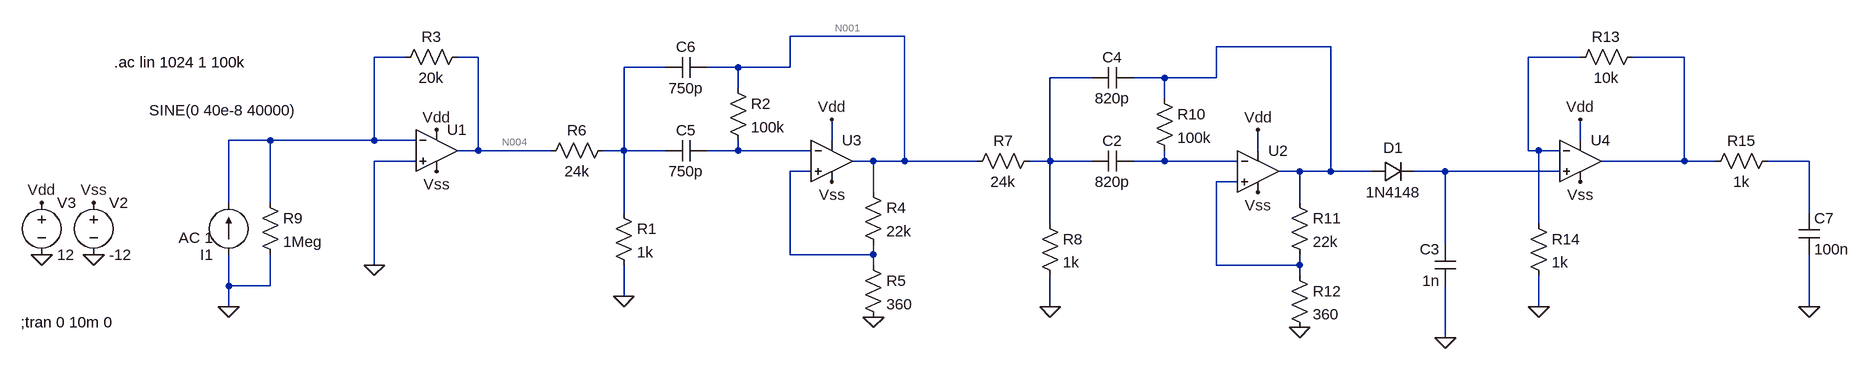
[diagram p0: schematic simulation20kHz(real).asc]
simulation20kHz(real).asc, the LTspice schematic file:
Version 4
SHEET 1 2420 680
WIRE 160 -224 -16 -224
WIRE 816 -208 640 -208
WIRE -608 -192 -656 -192
WIRE -496 -192 -528 -192
WIRE 1200 -192 1120 -192
WIRE 1360 -192 1280 -192
WIRE -208 -176 -272 -176
WIRE -96 -176 -144 -176
WIRE -16 -176 -16 -224
WIRE -16 -176 -96 -176
WIRE 448 -160 384 -160
WIRE 560 -160 512 -160
WIRE 640 -160 640 -208
WIRE 640 -160 560 -160
WIRE -96 -144 -96 -176
WIRE 560 -128 560 -160
WIRE -816 -64 -880 -64
WIRE -656 -64 -656 -192
WIRE -656 -64 -816 -64
WIRE -592 -64 -656 -64
WIRE 48 -64 48 -96
WIRE 1200 -64 1200 -96
WIRE -496 -48 -496 -192
WIRE -496 -48 -528 -48
WIRE -384 -48 -496 -48
WIRE -272 -48 -272 -176
WIRE -272 -48 -304 -48
WIRE -208 -48 -272 -48
WIRE -96 -48 -96 -64
WIRE -96 -48 -144 -48
WIRE 16 -48 -96 -48
WIRE 704 -48 704 -80
WIRE 1120 -48 1120 -192
WIRE 1136 -48 1120 -48
WIRE 1168 -48 1136 -48
WIRE -592 -32 -656 -32
WIRE 112 -32 80 -32
WIRE 160 -32 160 -224
WIRE 160 -32 112 -32
WIRE 272 -32 160 -32
WIRE 384 -32 384 -160
WIRE 384 -32 352 -32
WIRE 448 -32 384 -32
WIRE 560 -32 560 -48
WIRE 560 -32 512 -32
WIRE 672 -32 560 -32
WIRE 1360 -32 1360 -192
WIRE 1360 -32 1232 -32
WIRE 1408 -32 1360 -32
WIRE 1552 -32 1488 -32
WIRE 16 -16 -16 -16
WIRE 768 -16 736 -16
WIRE 816 -16 816 -208
WIRE 816 -16 768 -16
WIRE 880 -16 816 -16
WIRE 992 -16 944 -16
WIRE 1168 -16 992 -16
WIRE 672 0 640 0
WIRE 112 16 112 -32
WIRE -880 32 -880 -64
WIRE -816 32 -816 -64
WIRE 768 32 768 -16
WIRE -272 48 -272 -48
WIRE 1552 48 1552 -32
WIRE 384 64 384 -32
WIRE 1136 64 1136 -48
WIRE 992 96 992 -16
WIRE -16 112 -16 -16
WIRE 112 112 112 96
WIRE 112 112 -16 112
WIRE -656 128 -656 -32
WIRE 112 128 112 112
WIRE 640 128 640 0
WIRE 768 128 768 112
WIRE 768 128 640 128
WIRE 768 144 768 128
WIRE -880 160 -880 112
WIRE -816 160 -816 112
WIRE -816 160 -880 160
WIRE -272 176 -272 128
WIRE -880 192 -880 160
WIRE 384 192 384 144
WIRE 1136 192 1136 144
WIRE 1552 192 1552 112
WIRE 992 240 992 160
FLAG -1088 112 0
FLAG -1168 112 0
FLAG -1168 32 Vdd
FLAG -1088 32 Vss
FLAG -560 -16 Vss
FLAG -560 -80 Vdd
FLAG -880 192 0
FLAG -656 128 0
FLAG 48 0 Vss
FLAG 48 -96 Vdd
FLAG 112 208 0
FLAG -272 176 0
FLAG 704 16 Vss
FLAG 704 -80 Vdd
FLAG 768 224 0
FLAG 384 192 0
FLAG 1200 0 Vss
FLAG 1200 -96 Vdd
FLAG 992 240 0
FLAG 1136 192 0
FLAG 1552 192 0
SYMBOL Opamps\\UniversalOpamp2 -560 -48 R0
SYMATTR InstName U1
SYMBOL voltage -1088 16 R0
WINDOW 123 0 0 Left 2
WINDOW 39 0 0 Left 2
SYMATTR InstName V2
SYMATTR Value -12
SYMBOL voltage -1168 16 R0
SYMATTR InstName V3
SYMATTR Value 12
SYMBOL res -512 -208 R90
WINDOW 0 0 56 VBottom 2
WINDOW 3 32 56 VTop 2
SYMATTR InstName R3
SYMATTR Value 20k
SYMBOL current -880 112 R180
WINDOW 3 -106 222 Left 2
WINDOW 123 24 26 Left 2
WINDOW 39 0 0 Left 2
SYMATTR Value SINE(0 40e-8 40000)
SYMATTR Value2 AC 1
SYMATTR InstName I1
SYMBOL Opamps\\UniversalOpamp2 48 -32 R0
SYMATTR InstName U3
SYMBOL res -288 -64 R90
WINDOW 0 0 56 VBottom 2
WINDOW 3 32 56 VTop 2
SYMATTR InstName R6
SYMATTR Value 24k
SYMBOL res -832 16 R0
SYMATTR InstName R9
SYMATTR Value 1Meg
SYMBOL res -288 32 R0
SYMATTR InstName R1
SYMATTR Value 1k
SYMBOL cap -144 -64 R90
WINDOW 0 0 32 VBottom 2
WINDOW 3 32 32 VTop 2
SYMATTR InstName C5
SYMATTR Value 750p
SYMBOL cap -144 -192 R90
WINDOW 0 0 32 VBottom 2
WINDOW 3 32 32 VTop 2
SYMATTR InstName C6
SYMATTR Value 750p
SYMBOL res -112 -160 R0
SYMATTR InstName R2
SYMATTR Value 100k
SYMBOL res 96 0 R0
SYMATTR InstName R4
SYMATTR Value 22k
SYMBOL res 96 112 R0
SYMATTR InstName R5
SYMATTR Value 360
SYMBOL Opamps\\UniversalOpamp2 704 -16 R0
SYMATTR InstName U2
SYMBOL res 368 -48 R90
WINDOW 0 0 56 VBottom 2
WINDOW 3 32 56 VTop 2
SYMATTR InstName R7
SYMATTR Value 24k
SYMBOL res 368 48 R0
SYMATTR InstName R8
SYMATTR Value 1k
SYMBOL cap 512 -48 R90
WINDOW 0 0 32 VBottom 2
WINDOW 3 32 32 VTop 2
SYMATTR InstName C2
SYMATTR Value 820p
SYMBOL cap 512 -176 R90
WINDOW 0 0 32 VBottom 2
WINDOW 3 32 32 VTop 2
SYMATTR InstName C4
SYMATTR Value 820p
SYMBOL res 544 -144 R0
SYMATTR InstName R10
SYMATTR Value 100k
SYMBOL res 752 16 R0
SYMATTR InstName R11
SYMATTR Value 22k
SYMBOL res 752 128 R0
SYMATTR InstName R12
SYMATTR Value 360
SYMBOL Opamps\\UniversalOpamp2 1200 -32 R0
SYMATTR InstName U4
SYMBOL diode 880 0 R270
WINDOW 0 37 32 VTop 2
WINDOW 3 0 32 VBottom 2
SYMATTR InstName D1
SYMATTR Value 1N4148
SYMBOL cap 1008 160 R180
WINDOW 0 24 56 Left 2
WINDOW 3 24 8 Left 2
SYMATTR InstName C3
SYMATTR Value 1n
SYMBOL res 1296 -208 R90
WINDOW 0 0 56 VBottom 2
WINDOW 3 32 56 VTop 2
SYMATTR InstName R13
SYMATTR Value 10k
SYMBOL res 1120 48 R0
SYMATTR InstName R14
SYMATTR Value 1k
SYMBOL cap 1536 48 R0
SYMATTR InstName C7
SYMATTR Value 100n
SYMBOL res 1504 -48 R90
WINDOW 0 0 56 VBottom 2
WINDOW 3 32 56 VTop 2
SYMATTR InstName R15
SYMATTR Value 1k
TEXT -1200 216 Left 2 !;tran 0 10m 0
TEXT -1056 -184 Left 2 !.ac lin 1024 1 100k

The netlist it stands for:
* simulation20kHz(real).asc
XU1 0 N003 Vdd Vss N004 level.2 Avol=1Meg GBW=10Meg Slew=10Meg ilimit=25m rail=0 Vos=0 phimargin=45 en=0 enk=0 in=0 ink=0 Rin=500Meg  ; pins IN+ IN- V+ V- OUT
V2 Vss 0 -12
V3 Vdd 0 12
R3 N004 N003 20k
I1 0 N003 SINE(0 40e-8 40000) AC 1
XU3 N012 N009 Vdd Vss N001 level.2 Avol=1Meg GBW=10Meg Slew=10Meg ilimit=25m rail=0 Vos=0 phimargin=45 en=0 enk=0 in=0 ink=0 Rin=500Meg  ; pins IN+ IN- V+ V- OUT
R6 N007 N004 24k
R9 N003 0 1Meg
R1 N007 0 1k
C5 N009 N007 750p
C6 N001 N007 750p
R2 N001 N009 100k
R4 N001 N012 22k
R5 N012 0 360
XU2 N014 N010 Vdd Vss N002 level.2 Avol=1Meg GBW=10Meg Slew=10Meg ilimit=25m rail=0 Vos=0 phimargin=45 en=0 enk=0 in=0 ink=0 Rin=500Meg  ; pins IN+ IN- V+ V- OUT
R7 N008 N001 24k
R8 N008 0 1k
C2 N010 N008 820p
C4 N002 N008 820p
R10 N002 N010 100k
R11 N002 N014 22k
R12 N014 0 360
XU4 N013 N005 Vdd Vss N006 level.2 Avol=1Meg GBW=10Meg Slew=10Meg ilimit=25m rail=0 Vos=0 phimargin=45 en=0 enk=0 in=0 ink=0 Rin=500Meg  ; pins IN+ IN- V+ V- OUT
D1 N002 N013 1N4148
C3 0 N013 1n
R13 N006 N005 10k
R14 N005 0 1k
C7 N011 0 100n
R15 N011 N006 1k
.model D D
.lib standard.dio
;tran 0 10m 0
.ac lin 1024 1 100k
.lib UniversalOpamps2.sub
.backanno
.end

* Results of the author's LTspice run, read from the files saved beside the schematic
* Operating Point, zero values left out:
*   V(vdd) = 12 V
*   V(vss) = -12 V
*   I(V3) = -4.797 mA
*   I(V2) = 4.797 mA
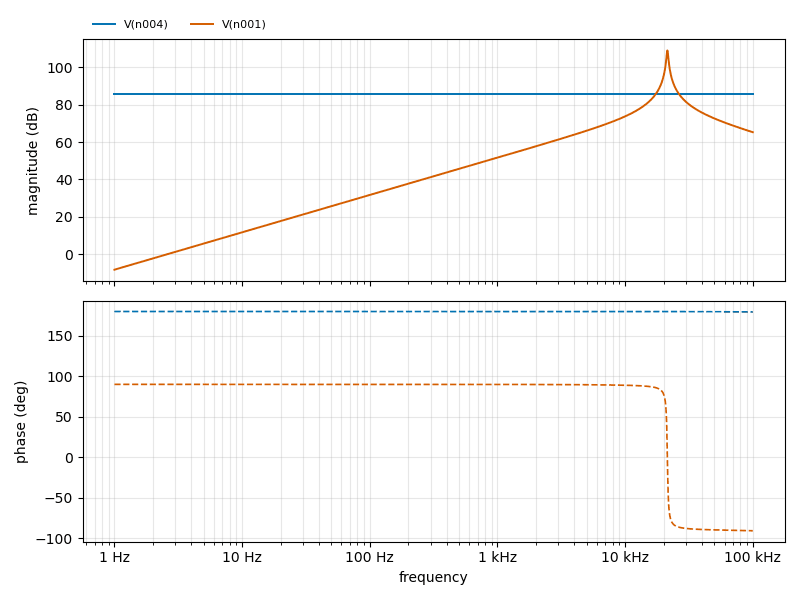
[diagram p1: AC Analysis of simulation20kHz(real).asc, plotted from the saved traces]
* AC Analysis, 1 run:
*   V(n004): 86.02 dB at 1 Hz, 86.02 dB at 100 kHz, peak 86.02 dB at 1 Hz
*   V(n001): -8.33 dB at 1 Hz, 65.30 dB at 100 kHz, peak 109.13 dB at 21.41 kHz, 3 dB below the peak at 21.11 kHz and 21.72 kHz